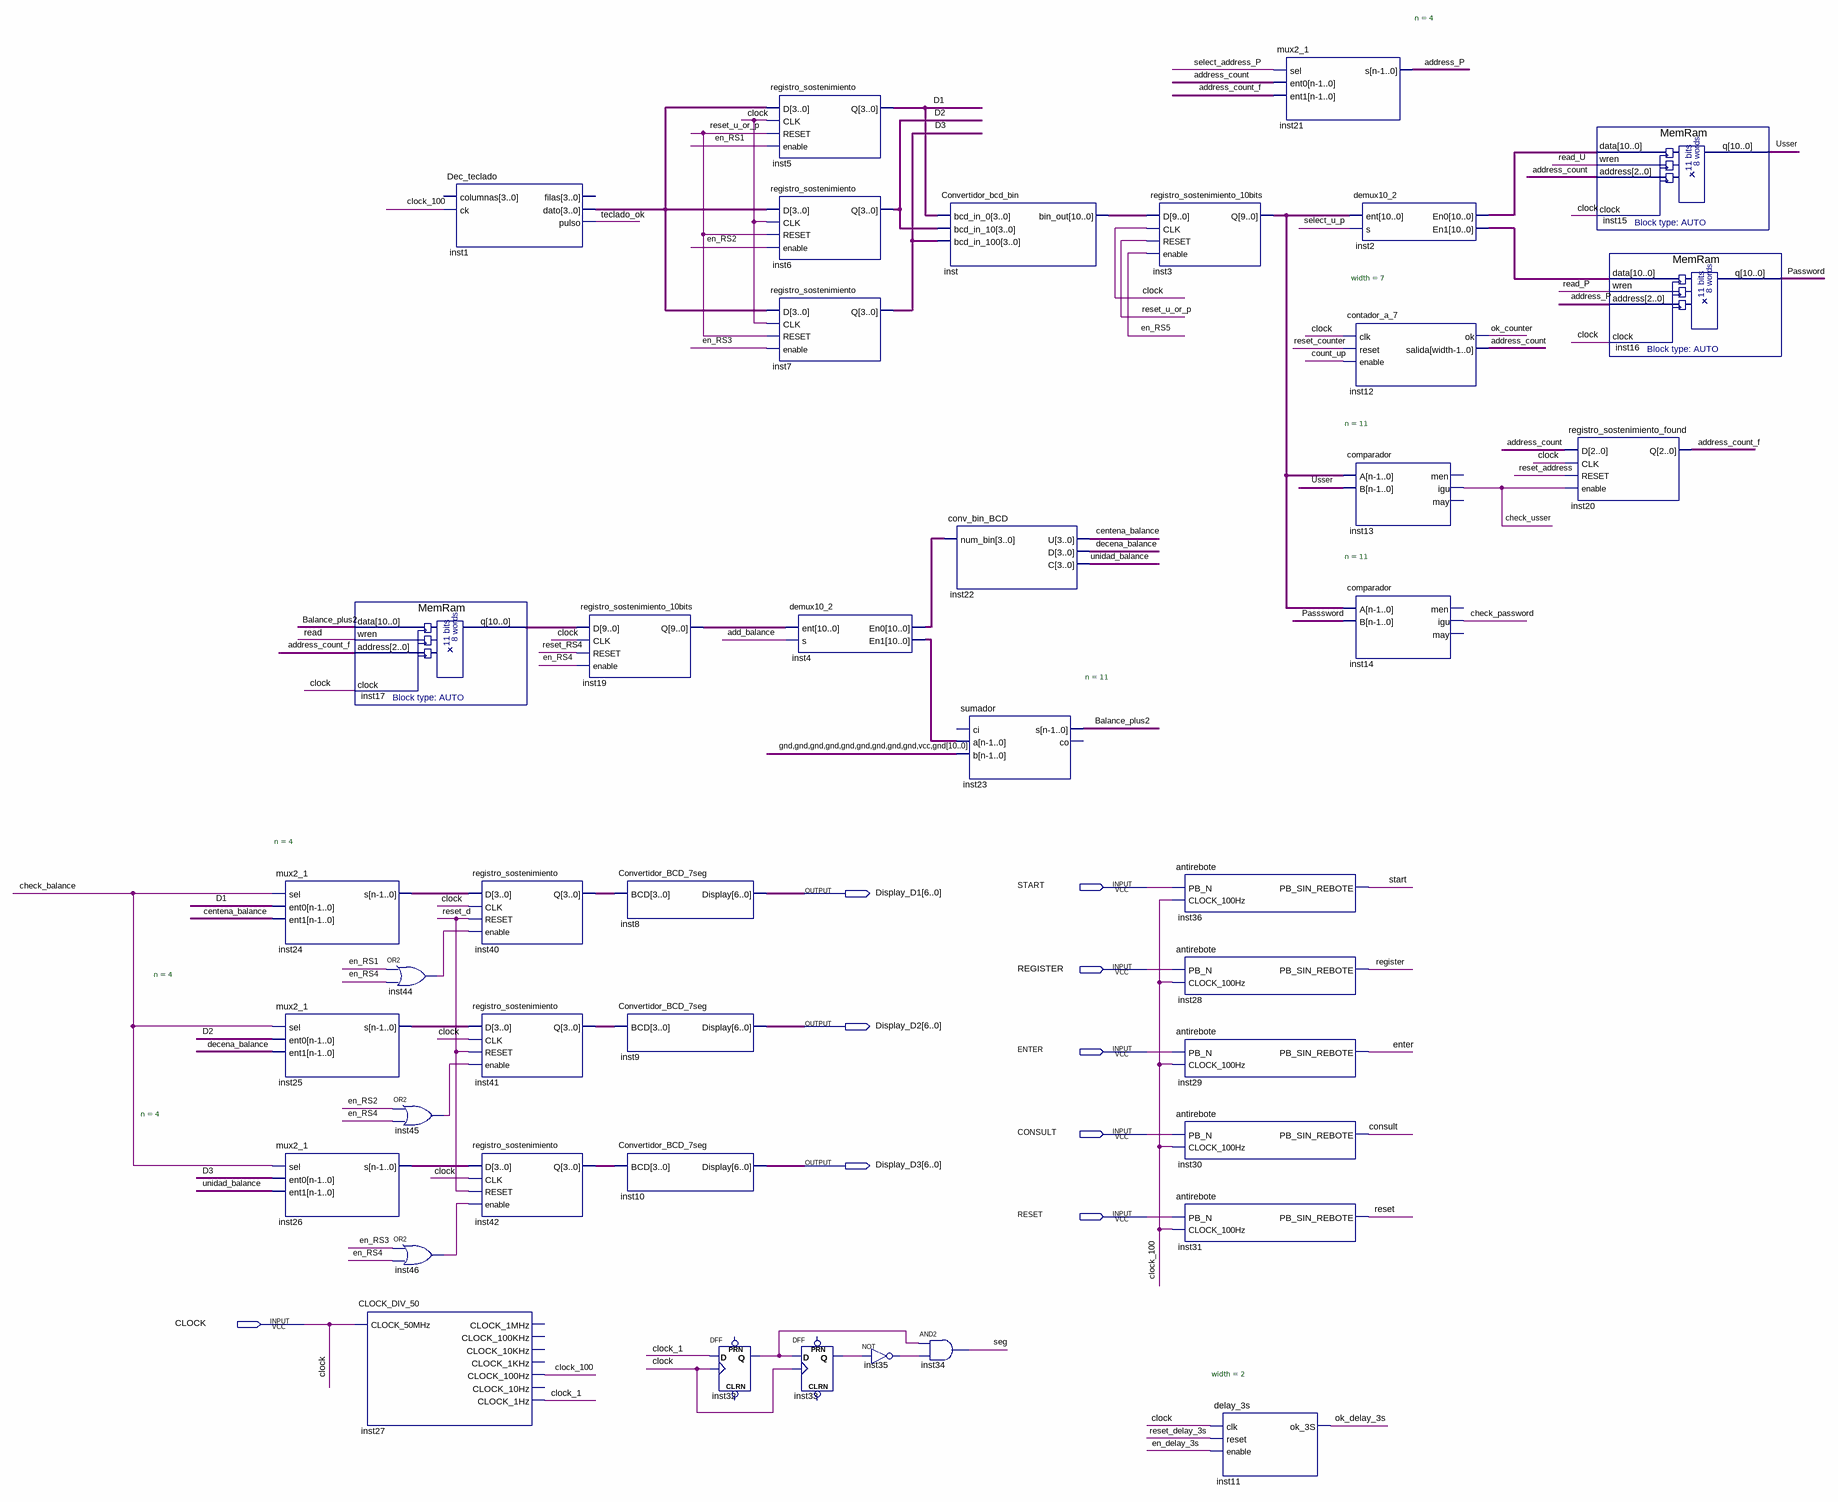
[diagram p0: schematic sheet]
// Quartus schematic RecolectorDeBotellas.bdf as structural Verilog: 42 symbols, 9 pins
module RecolectorDeBotellas (
  input  START,
  input  REGISTER,
  input  ENTER,
  input  CONSULT,
  input  RESET,
  input  CLOCK,
  output [6:0] Display_D1,
  output [6:0] Display_D2,
  output [6:0] Display_D3
);

  wire add_balance, address_count, address_count_f, address_P, Balance_plus2, centena_balance, check_balance,
       check_password, check_usser, clock_1, clock_100, count_up, D1, D2, D3, decena_balance, en_delay_3s,
       en_RS1, en_RS2, en_RS3, en_RS4, en_RS5, gnd_1bit, inst32_q, inst33_q, inst35_out, inst44_out,
       inst45_out, inst46_out, ok_counter, ok_delay_3s, Passsword, Password, read, read_P, read_U,
       reset_address, reset_counter, reset_d, reset_delay_3s, reset_RS4, reset_u_or_p, seg, select_address_P,
       select_u_p, teclado_ok, unidad_balance, Usser, vcc;
  wire [3:0] inst1_dato, inst24_s, inst25_s, inst26_s, inst40_q, inst41_q, inst42_q;
  wire [10:0] gnd, inst2_en0, inst2_en1, inst3_q, inst4_en0, inst4_en1, inst17_q, inst19_q, inst_bin_out;

  mux2_1 #(.n(4)) inst24 (.sel(check_balance), .ent0({4{D1}}), .ent1({4{centena_balance}}), .s(inst24_s));
  mux2_1 #(.n(4)) inst25 (.sel(check_balance), .ent0({4{D2}}), .ent1({4{decena_balance}}), .s(inst25_s));
  mux2_1 #(.n(4)) inst26 (.sel(check_balance), .ent0({4{D3}}), .ent1({4{unidad_balance}}), .s(inst26_s));
  MemRam inst17 (.data({11{Balance_plus2}}), .wren(read), .address({3{address_count_f}}), .clock(CLOCK), .q(inst17_q));
  or inst44 (inst44_out, en_RS1, en_RS4);
  or inst45 (inst45_out, en_RS2, en_RS4);
  or inst46 (inst46_out, en_RS3, en_RS4);
  CLOCK_DIV_50 inst27 (
    .CLOCK_50MHz(CLOCK), .CLOCK_100Hz(clock_100), .CLOCK_1Hz(clock_1));  // open: CLOCK_1MHz, CLOCK_100KHz, CLOCK_10KHz, CLOCK_1KHz, CLOCK_10Hz
  Dec_teclado inst1 (.ck(clock_100), .dato(inst1_dato), .pulso(teclado_ok));  // open: columnas, filas
  registro_sostenimiento inst40 (.D(inst24_s), .CLK(CLOCK), .RESET(reset_d), .enable(inst44_out), .Q(inst40_q));
  registro_sostenimiento inst41 (.D(inst25_s), .CLK(CLOCK), .RESET(reset_d), .enable(inst45_out), .Q(inst41_q));
  registro_sostenimiento inst42 (.D(inst26_s), .CLK(CLOCK), .RESET(reset_d), .enable(inst46_out), .Q(inst42_q));
  registro_sostenimiento_10bits inst19 (.D(inst17_q), .CLK(CLOCK), .RESET(reset_RS4), .enable(en_RS4), .Q(inst19_q));
  Convertidor_BCD_7seg inst8 (.BCD(inst40_q), .Display(Display_D1));
  Convertidor_BCD_7seg inst9 (.BCD(inst41_q), .Display(Display_D2));
  Convertidor_BCD_7seg inst10 (.BCD(inst42_q), .Display(Display_D3));
  DFF inst32 (.CLK(CLOCK), .D(clock_1), .Q(inst32_q));  // open: CLRN, PRN
  registro_sostenimiento inst5 (.D(inst1_dato), .CLK(CLOCK), .RESET(reset_u_or_p), .enable(en_RS1), .Q(D1));
  registro_sostenimiento inst6 (.D(inst1_dato), .CLK(CLOCK), .RESET(reset_u_or_p), .enable(en_RS2), .Q(D2));
  registro_sostenimiento inst7 (.D(inst1_dato), .CLK(CLOCK), .RESET(reset_u_or_p), .enable(en_RS3), .Q(D3));
  demux10_2 inst4 (.ent(inst19_q), .s(add_balance), .En0(inst4_en0), .En1(inst4_en1));
  DFF inst33 (.CLK(CLOCK), .D(inst32_q), .Q(inst33_q));  // open: CLRN, PRN
  not inst35 (inst35_out, inst33_q);
  Convertidor_bcd_bin inst (.bcd_in_0({4{D1}}), .bcd_in_10({4{D2}}), .bcd_in_100({4{D3}}), .bin_out(inst_bin_out));
  conv_bin_BCD inst22 (.num_bin(inst4_en0), .U(centena_balance), .D(decena_balance), .C(unidad_balance));
  sumador #(.n(11)) inst23 (.a(inst4_en1), .b({{9{gnd_1bit}}, vcc, gnd}), .s(Balance_plus2));  // open: ci, co
  and inst34 (seg, inst32_q, inst35_out);
  registro_sostenimiento_10bits inst3 (
    .D(inst_bin_out), .CLK(CLOCK), .RESET(reset_u_or_p), .enable(en_RS5), .Q(inst3_q));
  antirebote inst36 (.PB_N(START), .CLOCK_100Hz(clock_100), .PB_SIN_REBOTE(START));
  antirebote inst28 (.PB_N(REGISTER), .CLOCK_100Hz(clock_100), .PB_SIN_REBOTE(REGISTER));
  antirebote inst29 (.PB_N(ENTER), .CLOCK_100Hz(clock_100), .PB_SIN_REBOTE(ENTER));
  antirebote inst30 (.PB_N(CONSULT), .CLOCK_100Hz(clock_100), .PB_SIN_REBOTE(CONSULT));
  antirebote inst31 (.PB_N(RESET), .CLOCK_100Hz(clock_100), .PB_SIN_REBOTE(RESET));
  delay_3s #(.width(2)) inst11 (.clk(CLOCK), .reset(reset_delay_3s), .enable(en_delay_3s), .ok_3S(ok_delay_3s));
  mux2_1 #(.n(4)) inst21 (
    .sel(select_address_P), .ent0({4{address_count}}), .ent1({4{address_count_f}}), .s(address_P));
  demux10_2 inst2 (.ent(inst3_q), .s(select_u_p), .En0(inst2_en0), .En1(inst2_en1));
  contador_a_7 #(.width(7)) inst12 (
    .clk(CLOCK), .reset(reset_counter), .enable(count_up), .ok(ok_counter), .salida(address_count));
  comparador #(.n(11)) inst13 (.A(inst3_q), .B({11{Usser}}), .igu(check_usser));  // open: men, may
  comparador #(.n(11)) inst14 (.A(inst3_q), .B({11{Passsword}}), .igu(check_password));  // open: men, may
  registro_sostenimiento_found inst20 (
    .D({3{address_count}}), .CLK(CLOCK), .RESET(reset_address), .enable(check_usser), .Q(address_count_f));
  MemRam inst15 (.data(inst2_en0), .wren(read_U), .address({3{address_count}}), .clock(CLOCK), .q(Usser));
  MemRam inst16 (.data(inst2_en1), .wren(read_P), .address({3{address_P}}), .clock(CLOCK), .q(Password));
endmodule
